# Altium schematic sheet fan_control.SchDoc
size Letter; CompanyName: Carnegie Mellon University; Organization: Carnegie Mellon University; Address1: Carnegie Mellon University; Address2: Robotics Institute; Address3: 5000 Forbes Ave., 4208 NSH; Address4: Pittsburgh, PA 15213; DocumentNumber: 6; Revision: 1.0; SheetNumber: 6; SheetTotal: 8; PageSetup: Record=PageOptions|CenterHorizontal=True|CenterVertical=True|PrintScale=1.00|XCorrection=1.00|YCorrection=1.00|PrintKind=0|BorderSize=5000000|LeftOffset=0|BottomOffset=0|Orientation=2|PaperLength=1000|PaperWidth=1000|Scale=100|PaperSource=7|PrintQuality=-4|MediaType=1|DitherType=10|PaperKind=Letter|PrintScaleMode=1
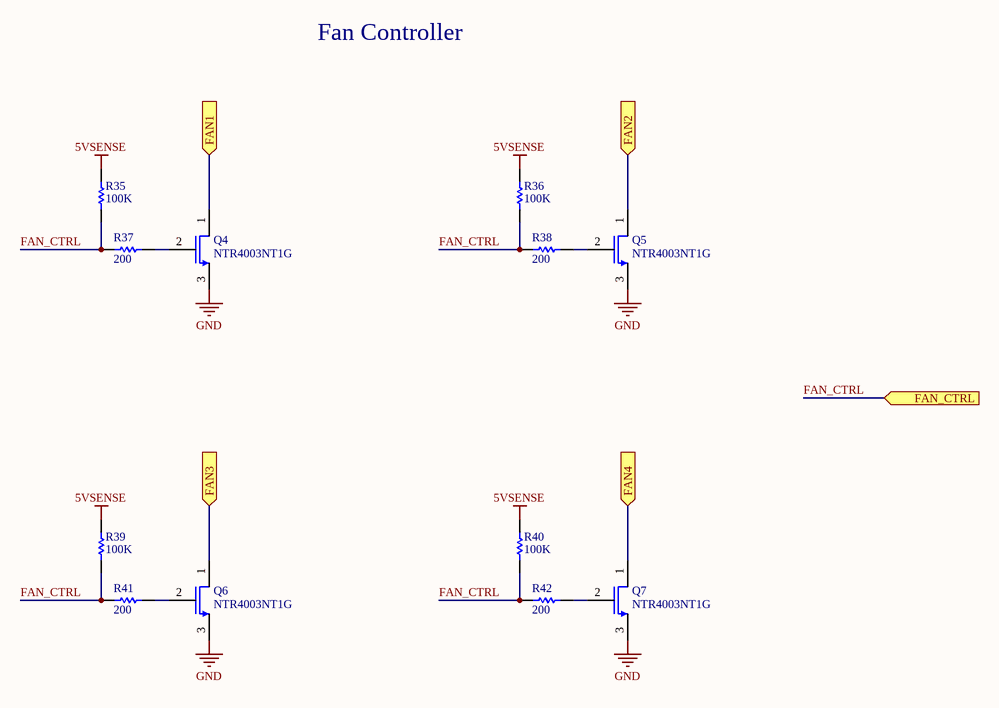
[diagram p0: fan_control.SchDoc]

## Parts
Q4  NTR4003NT1G  [SOT-23]
Q5  NTR4003NT1G  [SOT-23]
Q6  NTR4003NT1G  [SOT-23]
Q7  NTR4003NT1G  [SOT-23]
R35  100K  [RESC1608N]
R36  100K  [RESC1608N]
R37  200  [RESC1608N]
R38  200  [RESC1608N]
R39  100K  [RESC1608N]
R40  100K  [RESC1608N]
R41  200  [RESC1608N]
R42  200  [RESC1608N]

## Ports
FAN1 (in), FAN2 (in), FAN3 (in), FAN4 (in), FAN_CTRL (in)

## Nets
5VSENSE: R35.2 R36.2 R39.2 R40.2
GND: Q4.3 Q5.3 Q6.3 Q7.3
FAN1: Q4.1 ; port FAN1
FAN2: Q5.1 ; port FAN2
FAN3: Q6.1 ; port FAN3
FAN4: Q7.1 ; port FAN4
FAN_CTRL: R35.1 R36.1 R37.2 R38.2 R39.1 R40.1 R41.2 R42.2 ; port FAN_CTRL
NetQ4_2: Q4.2 R37.1
NetQ5_2: Q5.2 R38.1
NetQ6_2: Q6.2 R41.1
NetQ7_2: Q7.2 R42.1

## Notes on the sheet
- Fan Controller
- Title
- Size:
- Date:
- Letter
- Number:
- Time:
- Revision:
- Sheet
- of
- File:

## Library data of the parts
Q4-Q7 = NTR4003NT1G: N-Channel MOSFET; pin to pad: 1>3 2>1 3>2; Manufacturer: ON Semiconductor; Description: MOSFET N-CH 30V 500MA SOT-23; FET Type: MOSFET N-Channel, Metal Oxide; FET Feature: Standard; Drain to Source Voltage (Vdss): 30V; Current - Continuous Drain (Id) @ 25°C: 500mA (Ta); Rds On (Max) @ Id, Vgs: 1.5 Ohm @ 10mA, 4V; Vgs(th) (Max) @ Id: 1.4V @ 250µA; Gate Charge (Qg) @ Vgs: 1.15nC @ 5V; Input Capacitance (Ciss) @ Vds: 21pF @ 5V; Power - Max: 690mW; Supplier 1: Digi-Key; Supplier Part Number 1: NTR4003NT1GOSCT-ND; Manufacturer Part Number: NTR4003NT1G; RoHS: RoHS Compliant; Category: Discrete Semiconductor Products; Stock 1: 65978; Pricing 1: 1=0.27, 10=0.223, 100=0.118, 500=0.07758, 1000=0.05286 (USD); Packaging: Cut Tape (CT); Operating Temperature: -55°C ~ 150°C (TJ); Mounting Type: Surface Mount; Package / Case: TO-236-3, SC-59, SOT-23-3; Supplier Device Package: SOT-23-3 (TO-236); ComponentLink1URL: http://www.onsemi.com/pub_link/Collateral/NTR4003N-D.PDF; ComponentLink1Description: http://www.onsemi.com/pub_link/Collateral/NTR4003N-D.PDF
R35 R36 R39 R40 = Res1: Resistor; Manufacturer: Yageo; Manufacturer Part Number: RC0603JR-07100KL; Description: RES SMD 100K OHM 5% 1/10W 0603; Tolerance: ±5%; Power (Watts): 0.1W, 1/10W; Temperature Coefficient: ±100ppm/°C; Published: 8-Jun-2000; LatestRevisionDate: 17-Jul-2002; LatestRevisionNote: Re-released for DXP Platform.; PackageReference: AXIAL-0.3; Publisher: Altium Limited; PackageDescription: Axial Device, Thru-Hole; 2 Leads; 0.3 in Pin Spacing; Value: 100K; Supplier 1: Digi-Key; Supplier Part Number 1: 311-100KGRCT-ND; RoHS: RoHS Compliant; Category: Resistors; Stock 1: 1162719; Pricing 1: 1=0.1, 10=0.011, 25=0.008, 100=0.0044, 250=0.00336, 500=0.0027, 1000=0.00198, 2500=0.00172 (USD); Packaging: Cut Tape (CT); Resistance (Ohms): 100k; Composition: Thick Film; Features: Moisture Resistant; Operating Temperature: -55°C ~ 155°C; Package / Case: 0603 (1608 Metric); Supplier Device Package: 0603; Size / Dimension: 0.063" L x 0.031" W (1.60mm x 0.80mm); Height: 0.022" (0.55mm); Number of Terminations: 2; ComponentLink1URL: http://www.yageo.com/documents/recent/PYu-RC_Group_51_RoHS_L_04.pdf; ComponentLink1Description: http://www.yageo.com/documents/recent/PYu-RC_Group_51_RoHS_L_04.pdf
R37 R38 R41 R42 = Res1: Resistor; Manufacturer: Yageo; Manufacturer Part Number: RC0603JR-07200RL; Description: RES SMD 200 OHM 5% 1/10W 0603; Tolerance: ±5%; Power (Watts): 0.1W, 1/10W; Temperature Coefficient: ±100ppm/°C; Published: 8-Jun-2000; LatestRevisionDate: 17-Jul-2002; LatestRevisionNote: Re-released for DXP Platform.; PackageReference: AXIAL-0.3; Publisher: Altium Limited; PackageDescription: Axial Device, Thru-Hole; 2 Leads; 0.3 in Pin Spacing; Value: 200; Supplier 1: Digi-Key; Supplier Part Number 1: 311-200GRCT-ND; RoHS: RoHS Compliant; Category: Resistors; Stock 1: 267996; Pricing 1: 1=0.1, 10=0.011, 25=0.008, 100=0.0044, 250=0.00336, 500=0.0027, 1000=0.00198, 2500=0.00172 (USD); Packaging: Cut Tape (CT); Resistance (Ohms): 200; Composition: Thick Film; Features: Moisture Resistant; Operating Temperature: -55°C ~ 155°C; Package / Case: 0603 (1608 Metric); Supplier Device Package: 0603; Size / Dimension: 0.063" L x 0.031" W (1.60mm x 0.80mm); Height: 0.022" (0.55mm); Number of Terminations: 2; ComponentLink1URL: http://www.yageo.com/documents/recent/PYu-RC_Group_51_RoHS_L_04.pdf; ComponentLink1Description: http://www.yageo.com/documents/recent/PYu-RC_Group_51_RoHS_L_04.pdf